# Altium schematic sheet main_schematic.SchDoc
size A4
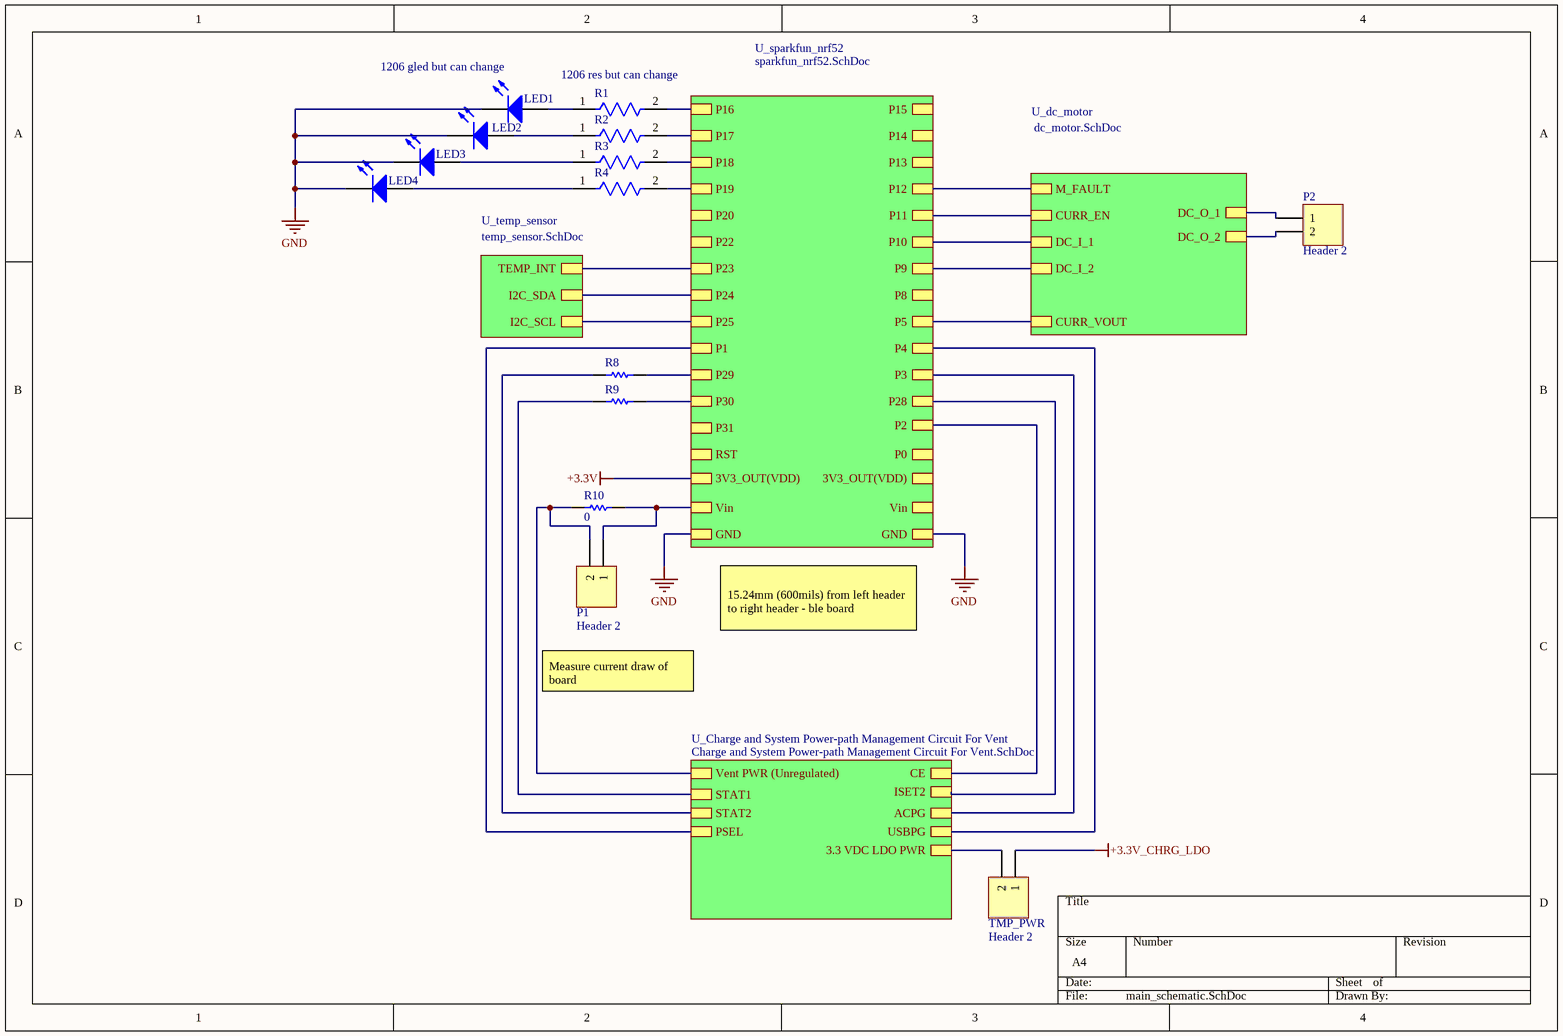
[diagram p0: main_schematic.SchDoc]

## Parts
LED1  (no value)  [1206_A]
LED2  (no value)  [1206_A]
LED3  (no value)  [1206_A]
LED4  (no value)  [1206_A]
P1  Header 2  [HDR1X2]
P2  Header 2  [HDR1X2]
R1  (no value)  [FP-RC1206-MFG]
R2  (no value)  [FP-RC1206-MFG]
R3  (no value)  [FP-RC1206-MFG]
R4  (no value)  [FP-RC1206-MFG]
R8  RC0805FR-0710KL  [RESC2013X60X35NL10T20]  (value not drawn)
R9  RC0805FR-0710KL  [RESC2013X60X35NL10T20]  (value not drawn)
R10  0  [RESC2013X70X40LL20T20]
TMP_PWR  Header 2  [HDR1X2]

## Sub-sheets
U_Charge and System Power-path Management Circuit For Vent = Charge and System Power-path Management Circuit For Vent.SchDoc: ISET2, STAT1, STAT2, USBPG, CE, PSEL, ACPG, Vent PWR (Unregulated), 3.3 VDC LDO PWR
U_dc_motor = dc_motor.SchDoc: DC_I_1, DC_I_2, M_FAULT, CURR_VOUT, CURR_EN, DC_O_2, DC_O_1
U_sparkfun_nrf52 = sparkfun_nrf52.SchDoc: P16, P17, P18, P19, P20, P22, P23, P24, P25, P28, P29, P30, P31, RST, Vin, GND, P15, P14, P13, P12, P11, P10, P9, P8, P5, P4, P3, P2, P1, P0, GND, 3V3_OUT(VDD), 3V3_OUT(VDD), Vin
U_temp_sensor = temp_sensor.SchDoc: I2C_SCL, TEMP_INT, I2C_SDA

## Nets
+3.3V: sheet U_sparkfun_nrf52/3V3_OUT(VDD)
+3.3V_CHRG_LDO: TMP_PWR.1
GND: LED1.1(K) LED2.1(K) LED3.1(K) LED4.1(K) ; sheet U_sparkfun_nrf52/GND, sheet U_sparkfun_nrf52/GND
NetLED1_2: LED1.2(A) R1.1
NetLED2_2: LED2.2(A) R2.1
NetLED3_2: LED3.2(A) R3.1
NetLED4_2: LED4.2(A) R4.1
NetP1_1: P1.1 R10.1 ; sheet U_sparkfun_nrf52/Vin
NetP1_2: P1.2 R10.2 ; sheet U_Charge and System Power-path Management Circuit For Vent/Vent PWR (Unregulated)
NetP2_1: P2.1 ; sheet U_dc_motor/DC_O_1
NetP2_2: P2.2 ; sheet U_dc_motor/DC_O_2
NetR1_2: R1.2 ; sheet U_sparkfun_nrf52/P16
NetR2_2: R2.2 ; sheet U_sparkfun_nrf52/P17
NetR3_2: R3.2 ; sheet U_sparkfun_nrf52/P18
NetR4_2: R4.2 ; sheet U_sparkfun_nrf52/P19
NetR8_1: R8.1 ; sheet U_Charge and System Power-path Management Circuit For Vent/STAT2
NetR8_2: R8.2 ; sheet U_sparkfun_nrf52/P29
NetR9_1: R9.1 ; sheet U_Charge and System Power-path Management Circuit For Vent/STAT1
NetR9_2: R9.2 ; sheet U_sparkfun_nrf52/P30
NetTMP_PWR_2: TMP_PWR.2 ; sheet U_Charge and System Power-path Management Circuit For Vent/3.3 VDC LDO PWR
(unnamed): sheet U_sparkfun_nrf52/P23, sheet U_temp_sensor/TEMP_INT
(unnamed): sheet U_sparkfun_nrf52/P24, sheet U_temp_sensor/I2C_SDA
(unnamed): sheet U_sparkfun_nrf52/P25, sheet U_temp_sensor/I2C_SCL
(unnamed): sheet U_sparkfun_nrf52/P28, sheet U_Charge and System Power-path Management Circuit For Vent/ISET2
(unnamed): sheet U_sparkfun_nrf52/P12, sheet U_dc_motor/M_FAULT
(unnamed): sheet U_sparkfun_nrf52/P11, sheet U_dc_motor/CURR_EN
(unnamed): sheet U_sparkfun_nrf52/P10, sheet U_dc_motor/DC_I_1
(unnamed): sheet U_sparkfun_nrf52/P9, sheet U_dc_motor/DC_I_2
(unnamed): sheet U_sparkfun_nrf52/P5, sheet U_dc_motor/CURR_VOUT
(unnamed): sheet U_sparkfun_nrf52/P4, sheet U_Charge and System Power-path Management Circuit For Vent/USBPG
(unnamed): sheet U_sparkfun_nrf52/P3, sheet U_Charge and System Power-path Management Circuit For Vent/ACPG
(unnamed): sheet U_sparkfun_nrf52/P2, sheet U_Charge and System Power-path Management Circuit For Vent/CE
(unnamed): sheet U_sparkfun_nrf52/P1, sheet U_Charge and System Power-path Management Circuit For Vent/PSEL

## Notes on the sheet
- (near LED1) 1206 gled but can change
- (near R1) 1206 res but can change
- 15.24mm (600mils) from left header to right header - ble board
- Measure current draw of board

## Library data of the parts
LED1-LED4 = CMP-1426-00016-1: QTLP650C4TR / 1206 green led; PartNumber: 150120VS75000; Manufacturer: Wuerth Elektronik; Color: Bright Green; ComponentLink2URL: http://katalog.we-online.com/led/datasheet/150120VS75000.pdf; ComponentLink2Description: Datasheet; ComponentLink1URL: http://www.we-online.com; PackageReference: 1206_A; ComponentLink1Description: Manufacturer URL
P1 P2 TMP_PWR = Header 2: Header, 2-Pin; LatestRevisionDate: 17-Jul-2002; LatestRevisionNote: Re-released for DXP Platform.; Publisher: Altium Limited
R1-R4 = CMP-03412-007570-1: 360 ohms resistor / 1206 package; Manufacturer Part Number: RC1206JR-070RL; Manufacturer: YAGEO; Voltage Rating: 200V; Temperature Coefficient: 300ppm/°C; Power Rating: 0.25W; Value: 0Ω; Tolerance: 5%; Temperature Range Low: -55°C; Category: Res; Automotive: No; Ipc Land Pattern Name: RESC310160X55; Device Class L1: Passive Components; Temperature: -55°C to +155°C; ComponentLink2URL: https://www.yageo.com/upload/media/product/productsearch/datasheet/rchip/PYu-RC_Group_51_RoHS_L_10.pdf; Lead Free: Yes; Height: 0.65mm; Footprint Url: https://www.yageo.com/upload/website/yageo_PYu-R_Mount_10_19050818_343.pdf; Package: RC1206; Digikey Description: RES SMD 0 OHM JUMPER 1/4W 1206; Temperature Range High: +155°C; Device Class L3: Chip SMD Resistors; Device Class L2: Resistors; Octopart: https://octopart.com/rc1206jr-070rl-yageo-40025601; Resistance: 0Ω; Series: RC; ComponentLink2Description: Datasheet; Composition: Thick Film; RoHS: TRUE; Mouser Description: Resistor: thick film; SMD; 1206; 0O; 0.25W; ±5%; -55÷155°C
R8 R9 = CMP-1659-00013-4: Chip Resistor, 10 KOhm, +/- 1%, 0.125 W, -55 to 155 degC, 0805 (2012 Metric), RoHS, Tape and Reel; Manufacturer: Yageo; Voltage Rating: 150 V; Mount: Surface Mount; ComponentLink1Description: Manufacturer URL; ComponentLink2URL: http://www.yageo.com/documents/recent/PYu-RC_Group_51_RoHS_L_04.pdf; Pins: 2; Length: 2 mm; Min Operating Temperature: -55 degC; Height: 0.5 mm; Mounting Technology: Surface Mount; RoHSCompliant: true; REACH SVHC: No SVHC; ComponentLink1URL: http://www.yageo.com/; Max Operating Temperature: 155 degC; PackageReference: 0805; DatasheetVersion: Rev. 4, 02/2016; Package Quantity: 5000; Packaging: Tape and Reel; ComponentLink2Description: Datasheet; PackageDescription: 2-Pin Surface Mounted Device, Body 2 x 1.25 mm
R10 = CMP-2001-00419-1: 2012; Part Number: ERJ-6GEYJ471V; Manufacturer: Panasonic